# Altium schematic sheet Sheet1.SchDoc
size A4
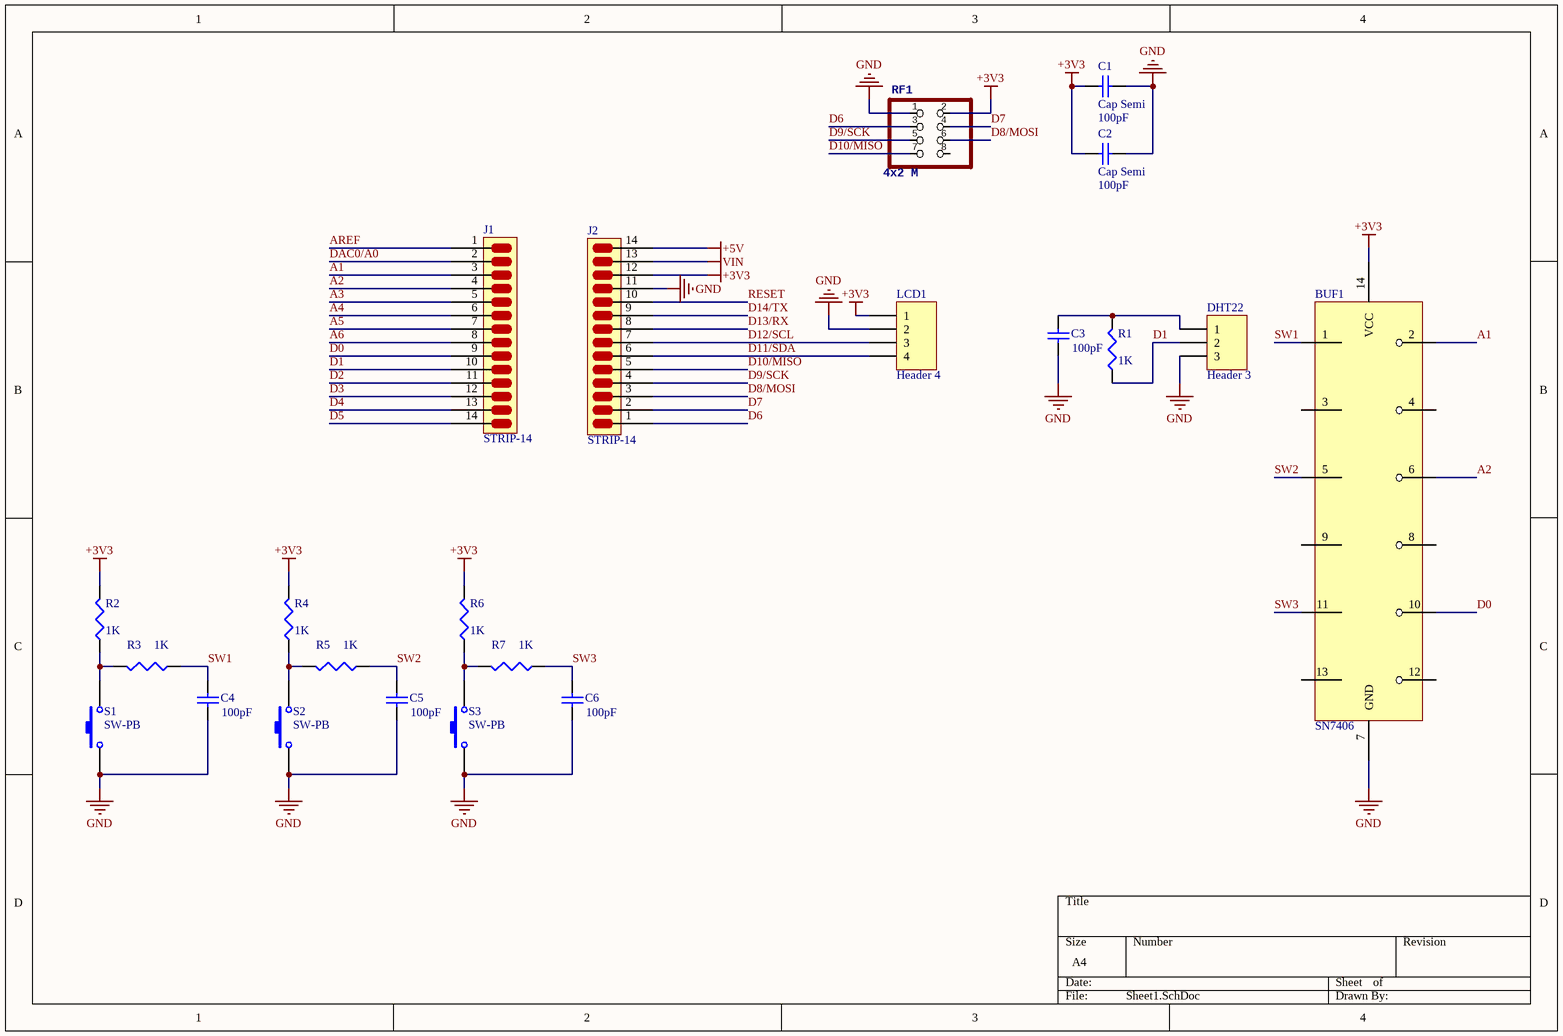
[diagram p0: Sheet1.SchDoc]

## Parts
BUF1  SN7406  [DIP14]
C1  Cap Semi  value 100pF  [C1206]
C2  Cap Semi  value 100pF  [C1206]
C3  value 100pF  [C1206]  (hidden comment: Cap Semi)
C4  value 100pF  [C1206]  (hidden comment: Cap Semi)
C5  value 100pF  [C1206]  (hidden comment: Cap Semi)
C6  value 100pF  [C1206]  (hidden comment: Cap Semi)
DHT22  Header 3  [HDR1X3]
J1  STRIP-14  [STRIP-14]
J2  STRIP-14  [STRIP-14]
LCD1  Header 4  [HDR1X4]
R1  value 1K  [J1-0603]  (hidden comment: Res3)
R2  value 1K  [J1-0603]  (hidden comment: Res3)
R3  value 1K  [J1-0603]  (hidden comment: Res3)
R4  value 1K  [J1-0603]  (hidden comment: Res3)
R5  value 1K  [J1-0603]  (hidden comment: Res3)
R6  value 1K  [J1-0603]  (hidden comment: Res3)
R7  value 1K  [J1-0603]  (hidden comment: Res3)
RF1  4x2 M  [2X04]
S1  SW-PB  [1080]
S2  SW-PB  [1080]
S3  SW-PB  [1080]

## Nets
+3V3: BUF1.14(VCC) C1.1 C2.1 J2.12 LCD1.1 R2.2 R4.2 R6.2 RF1.2
+5V: J2.14
GND: BUF1.7(GND) C1.2 C2.2 C3.1 C4.1 C5.1 C6.1 DHT22.3 J2.11 LCD1.2 RF1.1 S1.1 S2.1 S3.1
VIN: J2.13
A1: BUF1.2 J1.3
A2: BUF1.6 J1.4
A3: J1.5
A4: J1.6
A5: J1.7
A6: J1.8
AREF: J1.1
D0: BUF1.10 J1.9
D1: DHT22.2 J1.10 R1.1
D2: J1.11
D3: J1.12
D4: J1.13
D5: J1.14
D6: J2.1 RF1.3
D7: J2.2 RF1.4
D8/MOSI: J2.3 RF1.6
D9/SCK: J2.4 RF1.5
D10/MISO: J2.5 RF1.7
D11/SDA: J2.6 LCD1.4
D12/SCL: J2.7 LCD1.3
D13/RX: J2.8
D14/TX: J2.9
DAC0/A0: J1.2
RESET: J2.10
SW1: BUF1.1 C4.2 R3.1
SW2: BUF1.5 C5.2 R5.1
SW3: BUF1.11 C6.2 R7.1
NetC3_2: C3.2 DHT22.1 R1.2
NetR2_1: R2.1 R3.2 S1.2
NetR4_1: R4.1 R5.2 S2.2
NetR6_1: R6.1 R7.2 S3.2

Not connected (* = marked no-connect by the designer): BUF1 3 4 8 9 12 13; RF1 8

## Library data of the parts
C1-C6 = Cap Semi: Capacitor (Semiconductor SIM Model); Published: 8-Jun-2000; LatestRevisionDate: 29-May-2009; LatestRevisionNote: IPC-7351 Footprint Added.; PackageReference: C1206; Publisher: Altium Limited; PackageDescription: Chip Capacitor
DHT22 = Header 3: Header, 3-Pin; LatestRevisionDate: 17-Jul-2002; LatestRevisionNote: Re-released for DXP Platform.; Publisher: Altium Limited
LCD1 = Header 4: Header, 4-Pin; LatestRevisionDate: 17-Jul-2002; LatestRevisionNote: Re-released for DXP Platform.; Publisher: Altium Limited
R1-R7 = Res3: Resistor; Published: 8-Jun-2000; LatestRevisionDate: 29-May-2009; LatestRevisionNote: IPC-7351 Footprint Added.; PackageReference: J1-0603; Publisher: Altium Limited; PackageDescription: Chip Resistor
RF1 = PINHD-2X4: PartNo: M20-9980345
S1-S3 = SW-PB: Switch; Published: 24-Mar-1999; LatestRevisionDate: 17-Jul-2002; LatestRevisionNote: Re-released for DXP Platform.; PackageReference: SPST-2; Publisher: Altium Limited; PackageDescription: Switch; 2 Leads